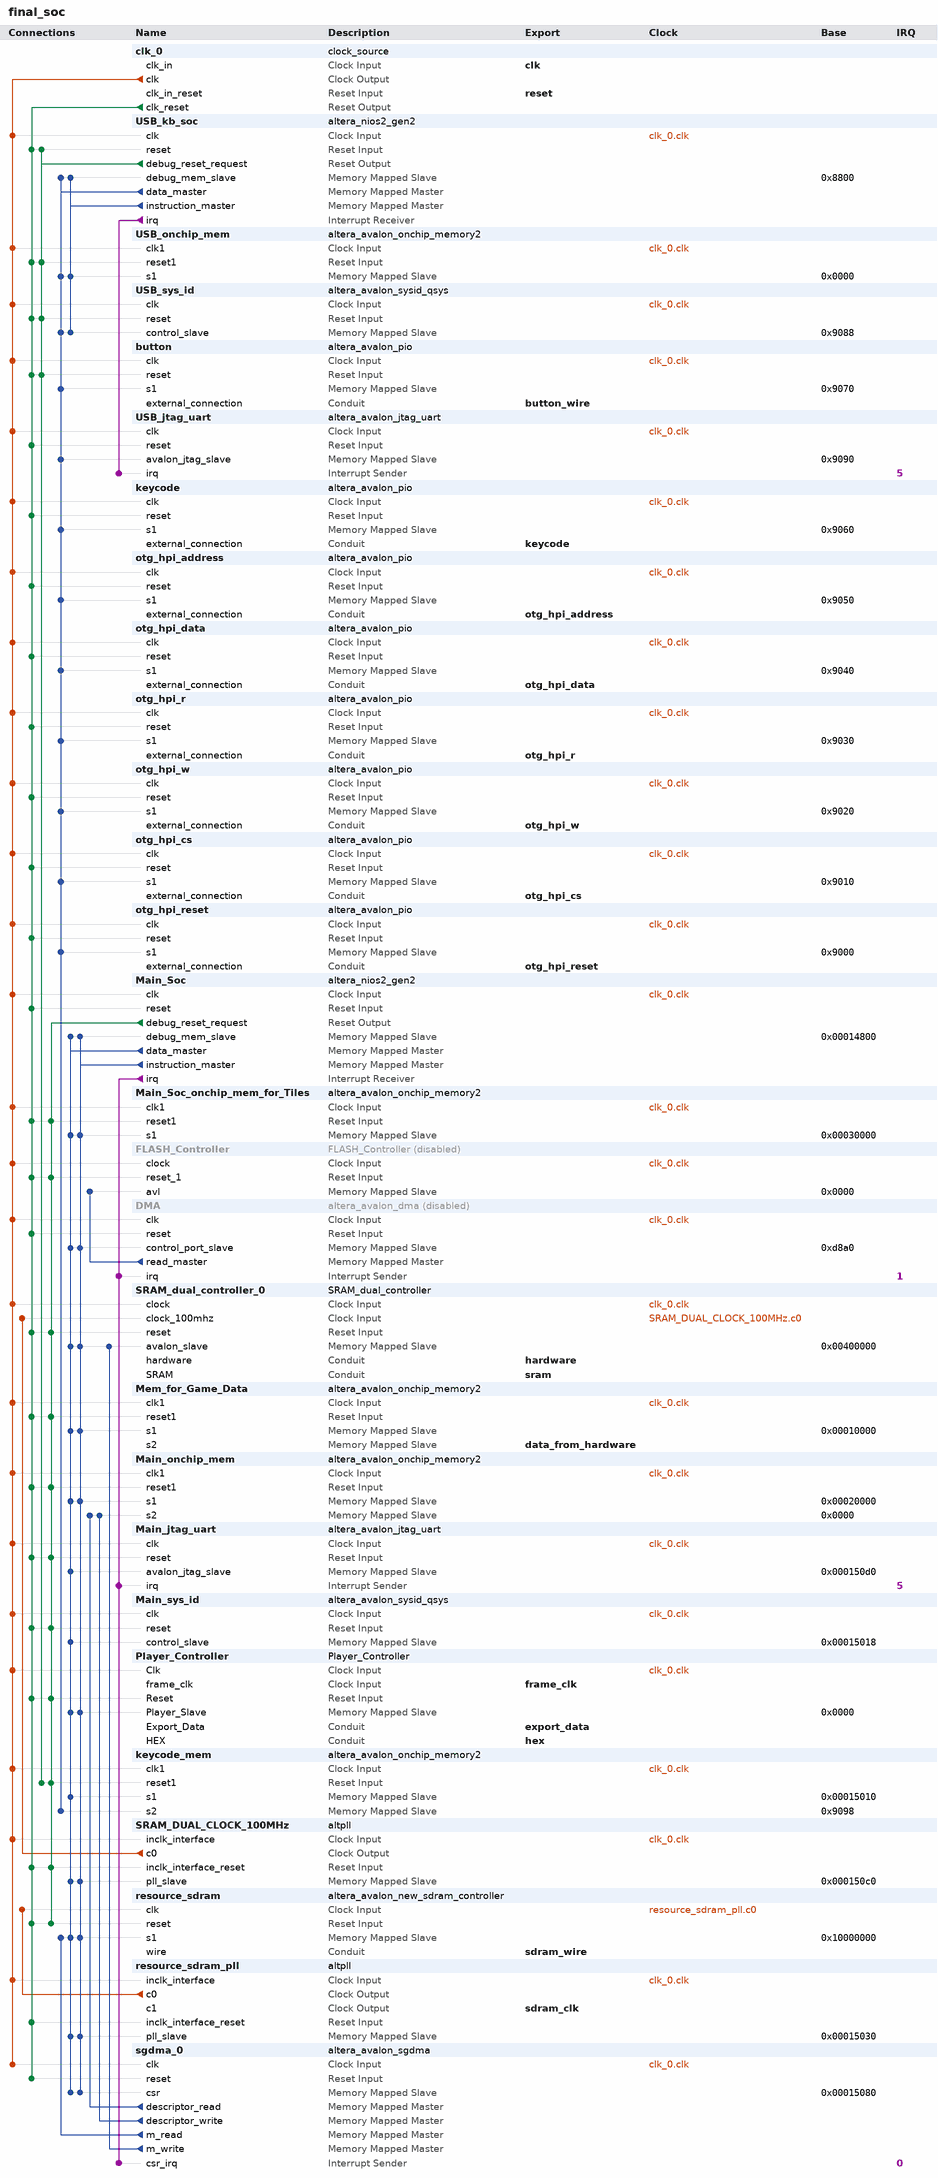
[diagram p0: system contents]
# Platform Designer (Qsys) system final_soc, Cyclone IV E EP4CE115F29C7
# Parameters at their usual value, and those the tool derives, are not listed.
package require -exact qsys 18.1
create_system final_soc
set_project_property DEVICE_FAMILY {Cyclone IV E}
set_project_property DEVICE EP4CE115F29C7

add_instance clk_0 clock_source 18.1
set_instance_parameter_value clk_0 clockFrequency 50000000

add_instance USB_kb_soc altera_nios2_gen2 18.1
set_instance_parameter_value USB_kb_soc dcache_size 2048
set_instance_parameter_value USB_kb_soc exceptionSlave USB_onchip_mem.s1
set_instance_parameter_value USB_kb_soc icache_size 4096
set_instance_parameter_value USB_kb_soc impl Tiny
set_instance_parameter_value USB_kb_soc resetSlave USB_onchip_mem.s1

add_instance USB_onchip_mem altera_avalon_onchip_memory2 18.1
set_instance_parameter_value USB_onchip_mem dataWidth 32
set_instance_parameter_value USB_onchip_mem dualPort false
set_instance_parameter_value USB_onchip_mem initMemContent true
set_instance_parameter_value USB_onchip_mem initializationFileName onchip_mem.hex
set_instance_parameter_value USB_onchip_mem memorySize 32768

add_instance USB_sys_id altera_avalon_sysid_qsys 18.1
set_instance_parameter_value USB_sys_id id 0

add_instance button altera_avalon_pio 18.1
set_instance_parameter_value button direction Input
set_instance_parameter_value button width 4

add_instance USB_jtag_uart altera_avalon_jtag_uart 18.1
set_instance_parameter_value USB_jtag_uart simInteractiveOptions NO_INTERACTIVE_WINDOWS

add_instance keycode altera_avalon_pio 18.1
set_instance_parameter_value keycode direction Output
set_instance_parameter_value keycode width 8

add_instance otg_hpi_address altera_avalon_pio 18.1
set_instance_parameter_value otg_hpi_address direction Output
set_instance_parameter_value otg_hpi_address width 2

add_instance otg_hpi_data altera_avalon_pio 18.1
set_instance_parameter_value otg_hpi_data direction InOut
set_instance_parameter_value otg_hpi_data width 16

add_instance otg_hpi_r altera_avalon_pio 18.1
set_instance_parameter_value otg_hpi_r direction Output
set_instance_parameter_value otg_hpi_r width 1

add_instance otg_hpi_w altera_avalon_pio 18.1
set_instance_parameter_value otg_hpi_w direction Output
set_instance_parameter_value otg_hpi_w width 1

add_instance otg_hpi_cs altera_avalon_pio 18.1
set_instance_parameter_value otg_hpi_cs direction Output
set_instance_parameter_value otg_hpi_cs width 1

add_instance otg_hpi_reset altera_avalon_pio 18.1
set_instance_parameter_value otg_hpi_reset direction Output
set_instance_parameter_value otg_hpi_reset width 1

add_instance Main_Soc altera_nios2_gen2 18.1
set_instance_parameter_value Main_Soc dcache_size 0
set_instance_parameter_value Main_Soc dividerType srt2
set_instance_parameter_value Main_Soc exceptionSlave Main_onchip_mem.s1
set_instance_parameter_value Main_Soc icache_size 4096
set_instance_parameter_value Main_Soc impl Tiny
set_instance_parameter_value Main_Soc resetSlave Main_onchip_mem.s1

add_instance Main_Soc_onchip_mem_for_Tiles altera_avalon_onchip_memory2 18.1
set_instance_parameter_value Main_Soc_onchip_mem_for_Tiles dataWidth 32
set_instance_parameter_value Main_Soc_onchip_mem_for_Tiles dualPort false
set_instance_parameter_value Main_Soc_onchip_mem_for_Tiles initMemContent true
set_instance_parameter_value Main_Soc_onchip_mem_for_Tiles initializationFileName onchip_mem.hex
set_instance_parameter_value Main_Soc_onchip_mem_for_Tiles memorySize 16384

add_instance FLASH_Controller FLASH_Controller 1.0
set_instance_property FLASH_Controller ENABLED false

add_instance DMA altera_avalon_dma 18.1
set_instance_property DMA ENABLED false
set_instance_parameter_value DMA allowByteTransactions true
set_instance_parameter_value DMA allowDoubleWordTransactions true
set_instance_parameter_value DMA allowHalfWordTransactions true
set_instance_parameter_value DMA allowQuadWordTransactions true
set_instance_parameter_value DMA burstEnable false
set_instance_parameter_value DMA fifoDepth 32
set_instance_parameter_value DMA maxBurstSize 128
set_instance_parameter_value DMA minimumDmaTransactionRegisterWidth 13

add_instance SRAM_dual_controller_0 SRAM_dual_controller 1.0

add_instance Mem_for_Game_Data altera_avalon_onchip_memory2 18.1
set_instance_parameter_value Mem_for_Game_Data blockType M9K
set_instance_parameter_value Mem_for_Game_Data dataWidth 32
set_instance_parameter_value Mem_for_Game_Data dualPort true
set_instance_parameter_value Mem_for_Game_Data enableDiffWidth true
set_instance_parameter_value Mem_for_Game_Data initMemContent true
set_instance_parameter_value Mem_for_Game_Data initializationFileName onchip_mem.hex
set_instance_parameter_value Mem_for_Game_Data memorySize 16384
set_instance_parameter_value Mem_for_Game_Data singleClockOperation true

add_instance Main_onchip_mem altera_avalon_onchip_memory2 18.1
set_instance_parameter_value Main_onchip_mem dataWidth 32
set_instance_parameter_value Main_onchip_mem dualPort true
set_instance_parameter_value Main_onchip_mem initMemContent true
set_instance_parameter_value Main_onchip_mem initializationFileName onchip_mem.hex
set_instance_parameter_value Main_onchip_mem memorySize 65536
set_instance_parameter_value Main_onchip_mem singleClockOperation true

add_instance Main_jtag_uart altera_avalon_jtag_uart 18.1
set_instance_parameter_value Main_jtag_uart simInteractiveOptions NO_INTERACTIVE_WINDOWS

add_instance Main_sys_id altera_avalon_sysid_qsys 18.1
set_instance_parameter_value Main_sys_id id 0

add_instance Player_Controller Player_Controller 2.3

add_instance keycode_mem altera_avalon_onchip_memory2 18.1
set_instance_parameter_value keycode_mem dataWidth 8
set_instance_parameter_value keycode_mem dualPort true
set_instance_parameter_value keycode_mem initMemContent true
set_instance_parameter_value keycode_mem initializationFileName onchip_mem.hex
set_instance_parameter_value keycode_mem memorySize 4
set_instance_parameter_value keycode_mem singleClockOperation true

add_instance SRAM_DUAL_CLOCK_100MHz altpll 18.1
set_instance_parameter_value SRAM_DUAL_CLOCK_100MHz CLK0_DIVIDE_BY 1
set_instance_parameter_value SRAM_DUAL_CLOCK_100MHz CLK0_MULTIPLY_BY 2
set_instance_parameter_value SRAM_DUAL_CLOCK_100MHz INCLK0_INPUT_FREQUENCY 20000
set_instance_parameter_value SRAM_DUAL_CLOCK_100MHz PORT_ARESET PORT_UNUSED
set_instance_parameter_value SRAM_DUAL_CLOCK_100MHz PORT_LOCKED PORT_UNUSED
set_instance_parameter_value SRAM_DUAL_CLOCK_100MHz PORT_clk1 PORT_UNUSED
set_instance_parameter_value SRAM_DUAL_CLOCK_100MHz PORT_clk2 PORT_UNUSED
set_instance_parameter_value SRAM_DUAL_CLOCK_100MHz PORT_clk3 PORT_UNUSED

add_instance resource_sdram altera_avalon_new_sdram_controller 18.1
set_instance_parameter_value resource_sdram TAC 5.5
set_instance_parameter_value resource_sdram TRCD 20.0
set_instance_parameter_value resource_sdram TRP 20.0
set_instance_parameter_value resource_sdram casLatency 3
set_instance_parameter_value resource_sdram columnWidth 10
set_instance_parameter_value resource_sdram dataWidth 32
set_instance_parameter_value resource_sdram generateSimulationModel false
set_instance_parameter_value resource_sdram model single_Micron_MT48LC4M32B2_7_chip
set_instance_parameter_value resource_sdram numberOfBanks 4
set_instance_parameter_value resource_sdram numberOfChipSelects 1
set_instance_parameter_value resource_sdram powerUpDelay 200.0
set_instance_parameter_value resource_sdram refreshPeriod 7.8125
set_instance_parameter_value resource_sdram rowWidth 13

add_instance resource_sdram_pll altpll 18.1
set_instance_parameter_value resource_sdram_pll CLK0_DIVIDE_BY 1
set_instance_parameter_value resource_sdram_pll CLK0_MULTIPLY_BY 1
set_instance_parameter_value resource_sdram_pll CLK1_DIVIDE_BY 1
set_instance_parameter_value resource_sdram_pll CLK1_DUTY_CYCLE 50
set_instance_parameter_value resource_sdram_pll CLK1_MULTIPLY_BY 1
set_instance_parameter_value resource_sdram_pll CLK1_PHASE_SHIFT -3000
set_instance_parameter_value resource_sdram_pll INCLK0_INPUT_FREQUENCY 20000
set_instance_parameter_value resource_sdram_pll PORT_ARESET PORT_UNUSED
set_instance_parameter_value resource_sdram_pll PORT_LOCKED PORT_UNUSED
set_instance_parameter_value resource_sdram_pll PORT_clk1 PORT_USED
set_instance_parameter_value resource_sdram_pll PORT_clk2 PORT_UNUSED
set_instance_parameter_value resource_sdram_pll PORT_clk3 PORT_UNUSED

add_instance sgdma_0 altera_avalon_sgdma 18.1
set_instance_parameter_value sgdma_0 enableBurstTransfers false
set_instance_parameter_value sgdma_0 enableUnalignedTransfers true
set_instance_parameter_value sgdma_0 readBlockDataWidth 32
set_instance_parameter_value sgdma_0 sinkErrorWidth 0
set_instance_parameter_value sgdma_0 sourceErrorWidth 0
set_instance_parameter_value sgdma_0 transferMode MEMORY_TO_MEMORY
set_instance_parameter_value sgdma_0 writeBurstcountWidth 4

# connections
add_connection clk_0.clk button.clk clock
add_connection clk_0.clk DMA.clk clock
add_connection clk_0.clk FLASH_Controller.clock clock
add_connection clk_0.clk keycode.clk clock
add_connection clk_0.clk keycode_mem.clk1 clock
add_connection clk_0.clk Main_jtag_uart.clk clock
add_connection clk_0.clk Main_onchip_mem.clk1 clock
add_connection clk_0.clk Main_Soc.clk clock
add_connection clk_0.clk Main_Soc_onchip_mem_for_Tiles.clk1 clock
add_connection clk_0.clk Main_sys_id.clk clock
add_connection clk_0.clk Mem_for_Game_Data.clk1 clock
add_connection clk_0.clk otg_hpi_address.clk clock
add_connection clk_0.clk otg_hpi_cs.clk clock
add_connection clk_0.clk otg_hpi_data.clk clock
add_connection clk_0.clk otg_hpi_r.clk clock
add_connection clk_0.clk otg_hpi_reset.clk clock
add_connection clk_0.clk otg_hpi_w.clk clock
add_connection clk_0.clk Player_Controller.Clk clock
add_connection clk_0.clk resource_sdram_pll.inclk_interface clock
add_connection clk_0.clk sgdma_0.clk clock
add_connection clk_0.clk SRAM_DUAL_CLOCK_100MHz.inclk_interface clock
add_connection clk_0.clk SRAM_dual_controller_0.clock clock
add_connection clk_0.clk USB_jtag_uart.clk clock
add_connection clk_0.clk USB_kb_soc.clk clock
add_connection clk_0.clk USB_onchip_mem.clk1 clock
add_connection clk_0.clk USB_sys_id.clk clock
add_connection resource_sdram_pll.c0 resource_sdram.clk clock
add_connection SRAM_DUAL_CLOCK_100MHz.c0 SRAM_dual_controller_0.clock_100mhz clock
add_connection clk_0.clk_reset button.reset reset
add_connection clk_0.clk_reset DMA.reset reset
add_connection clk_0.clk_reset FLASH_Controller.reset_1 reset
add_connection clk_0.clk_reset keycode.reset reset
add_connection clk_0.clk_reset Main_jtag_uart.reset reset
add_connection clk_0.clk_reset Main_onchip_mem.reset1 reset
add_connection clk_0.clk_reset Main_Soc.reset reset
add_connection clk_0.clk_reset Main_Soc_onchip_mem_for_Tiles.reset1 reset
add_connection clk_0.clk_reset Main_sys_id.reset reset
add_connection clk_0.clk_reset Mem_for_Game_Data.reset1 reset
add_connection clk_0.clk_reset otg_hpi_address.reset reset
add_connection clk_0.clk_reset otg_hpi_cs.reset reset
add_connection clk_0.clk_reset otg_hpi_data.reset reset
add_connection clk_0.clk_reset otg_hpi_r.reset reset
add_connection clk_0.clk_reset otg_hpi_reset.reset reset
add_connection clk_0.clk_reset otg_hpi_w.reset reset
add_connection clk_0.clk_reset Player_Controller.Reset reset
add_connection clk_0.clk_reset resource_sdram.reset reset
add_connection clk_0.clk_reset resource_sdram_pll.inclk_interface_reset reset
add_connection clk_0.clk_reset sgdma_0.reset reset
add_connection clk_0.clk_reset SRAM_DUAL_CLOCK_100MHz.inclk_interface_reset reset
add_connection clk_0.clk_reset SRAM_dual_controller_0.reset reset
add_connection clk_0.clk_reset USB_jtag_uart.reset reset
add_connection clk_0.clk_reset USB_kb_soc.reset reset
add_connection clk_0.clk_reset USB_onchip_mem.reset1 reset
add_connection clk_0.clk_reset USB_sys_id.reset reset
add_connection Main_Soc.debug_reset_request FLASH_Controller.reset_1 reset
add_connection Main_Soc.debug_reset_request keycode_mem.reset1 reset
add_connection Main_Soc.debug_reset_request Main_jtag_uart.reset reset
add_connection Main_Soc.debug_reset_request Main_onchip_mem.reset1 reset
add_connection Main_Soc.debug_reset_request Main_Soc_onchip_mem_for_Tiles.reset1 reset
add_connection Main_Soc.debug_reset_request Main_sys_id.reset reset
add_connection Main_Soc.debug_reset_request Mem_for_Game_Data.reset1 reset
add_connection Main_Soc.debug_reset_request Player_Controller.Reset reset
add_connection Main_Soc.debug_reset_request resource_sdram.reset reset
add_connection Main_Soc.debug_reset_request SRAM_DUAL_CLOCK_100MHz.inclk_interface_reset reset
add_connection Main_Soc.debug_reset_request SRAM_dual_controller_0.reset reset
add_connection USB_kb_soc.debug_reset_request button.reset reset
add_connection USB_kb_soc.debug_reset_request keycode_mem.reset1 reset
add_connection USB_kb_soc.debug_reset_request USB_kb_soc.reset reset
add_connection USB_kb_soc.debug_reset_request USB_onchip_mem.reset1 reset
add_connection USB_kb_soc.debug_reset_request USB_sys_id.reset reset
add_connection DMA.read_master FLASH_Controller.avl avalon
set_connection_parameter_value DMA.read_master/FLASH_Controller.avl baseAddress 0x0000
add_connection Main_Soc.data_master DMA.control_port_slave avalon
set_connection_parameter_value Main_Soc.data_master/DMA.control_port_slave baseAddress 0xd8a0
add_connection Main_Soc.data_master keycode_mem.s1 avalon
set_connection_parameter_value Main_Soc.data_master/keycode_mem.s1 baseAddress 0x00015010
add_connection Main_Soc.data_master Main_jtag_uart.avalon_jtag_slave avalon
set_connection_parameter_value Main_Soc.data_master/Main_jtag_uart.avalon_jtag_slave baseAddress 0x000150d0
add_connection Main_Soc.data_master Main_onchip_mem.s1 avalon
set_connection_parameter_value Main_Soc.data_master/Main_onchip_mem.s1 baseAddress 0x00020000
add_connection Main_Soc.data_master Main_Soc.debug_mem_slave avalon
set_connection_parameter_value Main_Soc.data_master/Main_Soc.debug_mem_slave baseAddress 0x00014800
add_connection Main_Soc.data_master Main_Soc_onchip_mem_for_Tiles.s1 avalon
set_connection_parameter_value Main_Soc.data_master/Main_Soc_onchip_mem_for_Tiles.s1 baseAddress 0x00030000
add_connection Main_Soc.data_master Main_sys_id.control_slave avalon
set_connection_parameter_value Main_Soc.data_master/Main_sys_id.control_slave baseAddress 0x00015018
add_connection Main_Soc.data_master Mem_for_Game_Data.s1 avalon
set_connection_parameter_value Main_Soc.data_master/Mem_for_Game_Data.s1 baseAddress 0x00010000
add_connection Main_Soc.data_master Player_Controller.Player_Slave avalon
set_connection_parameter_value Main_Soc.data_master/Player_Controller.Player_Slave baseAddress 0x0000
add_connection Main_Soc.data_master resource_sdram.s1 avalon
set_connection_parameter_value Main_Soc.data_master/resource_sdram.s1 baseAddress 0x10000000
add_connection Main_Soc.data_master resource_sdram_pll.pll_slave avalon
set_connection_parameter_value Main_Soc.data_master/resource_sdram_pll.pll_slave baseAddress 0x00015030
add_connection Main_Soc.data_master sgdma_0.csr avalon
set_connection_parameter_value Main_Soc.data_master/sgdma_0.csr baseAddress 0x00015080
add_connection Main_Soc.data_master SRAM_DUAL_CLOCK_100MHz.pll_slave avalon
set_connection_parameter_value Main_Soc.data_master/SRAM_DUAL_CLOCK_100MHz.pll_slave baseAddress 0x000150c0
add_connection Main_Soc.data_master SRAM_dual_controller_0.avalon_slave avalon
set_connection_parameter_value Main_Soc.data_master/SRAM_dual_controller_0.avalon_slave baseAddress 0x00400000
add_connection Main_Soc.instruction_master DMA.control_port_slave avalon
set_connection_parameter_value Main_Soc.instruction_master/DMA.control_port_slave baseAddress 0xd8a0
add_connection Main_Soc.instruction_master Main_onchip_mem.s1 avalon
set_connection_parameter_value Main_Soc.instruction_master/Main_onchip_mem.s1 baseAddress 0x00020000
add_connection Main_Soc.instruction_master Main_Soc.debug_mem_slave avalon
set_connection_parameter_value Main_Soc.instruction_master/Main_Soc.debug_mem_slave baseAddress 0x00014800
add_connection Main_Soc.instruction_master Main_Soc_onchip_mem_for_Tiles.s1 avalon
set_connection_parameter_value Main_Soc.instruction_master/Main_Soc_onchip_mem_for_Tiles.s1 baseAddress 0x00030000
add_connection Main_Soc.instruction_master Mem_for_Game_Data.s1 avalon
set_connection_parameter_value Main_Soc.instruction_master/Mem_for_Game_Data.s1 baseAddress 0x00010000
add_connection Main_Soc.instruction_master Player_Controller.Player_Slave avalon
set_connection_parameter_value Main_Soc.instruction_master/Player_Controller.Player_Slave baseAddress 0x0000
add_connection Main_Soc.instruction_master resource_sdram.s1 avalon
set_connection_parameter_value Main_Soc.instruction_master/resource_sdram.s1 baseAddress 0x10000000
add_connection Main_Soc.instruction_master resource_sdram_pll.pll_slave avalon
set_connection_parameter_value Main_Soc.instruction_master/resource_sdram_pll.pll_slave baseAddress 0x00015030
add_connection Main_Soc.instruction_master sgdma_0.csr avalon
set_connection_parameter_value Main_Soc.instruction_master/sgdma_0.csr baseAddress 0x00015080
add_connection Main_Soc.instruction_master SRAM_DUAL_CLOCK_100MHz.pll_slave avalon
set_connection_parameter_value Main_Soc.instruction_master/SRAM_DUAL_CLOCK_100MHz.pll_slave baseAddress 0x000150c0
add_connection Main_Soc.instruction_master SRAM_dual_controller_0.avalon_slave avalon
set_connection_parameter_value Main_Soc.instruction_master/SRAM_dual_controller_0.avalon_slave baseAddress 0x00400000
add_connection sgdma_0.descriptor_read Main_onchip_mem.s2 avalon
set_connection_parameter_value sgdma_0.descriptor_read/Main_onchip_mem.s2 baseAddress 0x0000
add_connection sgdma_0.descriptor_write Main_onchip_mem.s2 avalon
set_connection_parameter_value sgdma_0.descriptor_write/Main_onchip_mem.s2 baseAddress 0x0000
add_connection sgdma_0.m_read resource_sdram.s1 avalon
set_connection_parameter_value sgdma_0.m_read/resource_sdram.s1 baseAddress 0x10000000
add_connection sgdma_0.m_write SRAM_dual_controller_0.avalon_slave avalon
set_connection_parameter_value sgdma_0.m_write/SRAM_dual_controller_0.avalon_slave baseAddress 0x00400000
add_connection USB_kb_soc.data_master button.s1 avalon
set_connection_parameter_value USB_kb_soc.data_master/button.s1 baseAddress 0x9070
add_connection USB_kb_soc.data_master keycode.s1 avalon
set_connection_parameter_value USB_kb_soc.data_master/keycode.s1 baseAddress 0x9060
add_connection USB_kb_soc.data_master keycode_mem.s2 avalon
set_connection_parameter_value USB_kb_soc.data_master/keycode_mem.s2 baseAddress 0x9098
add_connection USB_kb_soc.data_master otg_hpi_address.s1 avalon
set_connection_parameter_value USB_kb_soc.data_master/otg_hpi_address.s1 baseAddress 0x9050
add_connection USB_kb_soc.data_master otg_hpi_cs.s1 avalon
set_connection_parameter_value USB_kb_soc.data_master/otg_hpi_cs.s1 baseAddress 0x9010
add_connection USB_kb_soc.data_master otg_hpi_data.s1 avalon
set_connection_parameter_value USB_kb_soc.data_master/otg_hpi_data.s1 baseAddress 0x9040
add_connection USB_kb_soc.data_master otg_hpi_r.s1 avalon
set_connection_parameter_value USB_kb_soc.data_master/otg_hpi_r.s1 baseAddress 0x9030
add_connection USB_kb_soc.data_master otg_hpi_reset.s1 avalon
set_connection_parameter_value USB_kb_soc.data_master/otg_hpi_reset.s1 baseAddress 0x9000
add_connection USB_kb_soc.data_master otg_hpi_w.s1 avalon
set_connection_parameter_value USB_kb_soc.data_master/otg_hpi_w.s1 baseAddress 0x9020
add_connection USB_kb_soc.data_master USB_jtag_uart.avalon_jtag_slave avalon
set_connection_parameter_value USB_kb_soc.data_master/USB_jtag_uart.avalon_jtag_slave baseAddress 0x9090
add_connection USB_kb_soc.data_master USB_kb_soc.debug_mem_slave avalon
set_connection_parameter_value USB_kb_soc.data_master/USB_kb_soc.debug_mem_slave baseAddress 0x8800
add_connection USB_kb_soc.data_master USB_onchip_mem.s1 avalon
set_connection_parameter_value USB_kb_soc.data_master/USB_onchip_mem.s1 baseAddress 0x0000
add_connection USB_kb_soc.data_master USB_sys_id.control_slave avalon
set_connection_parameter_value USB_kb_soc.data_master/USB_sys_id.control_slave baseAddress 0x9088
add_connection USB_kb_soc.instruction_master USB_kb_soc.debug_mem_slave avalon
set_connection_parameter_value USB_kb_soc.instruction_master/USB_kb_soc.debug_mem_slave baseAddress 0x8800
add_connection USB_kb_soc.instruction_master USB_onchip_mem.s1 avalon
set_connection_parameter_value USB_kb_soc.instruction_master/USB_onchip_mem.s1 baseAddress 0x0000
add_connection USB_kb_soc.instruction_master USB_sys_id.control_slave avalon
set_connection_parameter_value USB_kb_soc.instruction_master/USB_sys_id.control_slave baseAddress 0x9088
add_connection Main_Soc.irq DMA.irq interrupt
set_connection_parameter_value Main_Soc.irq/DMA.irq irqNumber 1
add_connection Main_Soc.irq Main_jtag_uart.irq interrupt
set_connection_parameter_value Main_Soc.irq/Main_jtag_uart.irq irqNumber 5
add_connection Main_Soc.irq sgdma_0.csr_irq interrupt
set_connection_parameter_value Main_Soc.irq/sgdma_0.csr_irq irqNumber 0
add_connection USB_kb_soc.irq USB_jtag_uart.irq interrupt
set_connection_parameter_value USB_kb_soc.irq/USB_jtag_uart.irq irqNumber 5

# exported interfaces
add_interface button_wire conduit end
set_interface_property button_wire EXPORT_OF button.external_connection
add_interface clk clock sink
set_interface_property clk EXPORT_OF clk_0.clk_in
add_interface data_from_hardware avalon slave
set_interface_property data_from_hardware EXPORT_OF Mem_for_Game_Data.s2
add_interface export_data conduit end
set_interface_property export_data EXPORT_OF Player_Controller.Export_Data
add_interface frame_clk clock sink
set_interface_property frame_clk EXPORT_OF Player_Controller.frame_clk
add_interface hardware conduit end
set_interface_property hardware EXPORT_OF SRAM_dual_controller_0.hardware
add_interface hex conduit end
set_interface_property hex EXPORT_OF Player_Controller.HEX
add_interface keycode conduit end
set_interface_property keycode EXPORT_OF keycode.external_connection
add_interface otg_hpi_address conduit end
set_interface_property otg_hpi_address EXPORT_OF otg_hpi_address.external_connection
add_interface otg_hpi_cs conduit end
set_interface_property otg_hpi_cs EXPORT_OF otg_hpi_cs.external_connection
add_interface otg_hpi_data conduit end
set_interface_property otg_hpi_data EXPORT_OF otg_hpi_data.external_connection
add_interface otg_hpi_r conduit end
set_interface_property otg_hpi_r EXPORT_OF otg_hpi_r.external_connection
add_interface otg_hpi_reset conduit end
set_interface_property otg_hpi_reset EXPORT_OF otg_hpi_reset.external_connection
add_interface otg_hpi_w conduit end
set_interface_property otg_hpi_w EXPORT_OF otg_hpi_w.external_connection
add_interface reset reset sink
set_interface_property reset EXPORT_OF clk_0.clk_in_reset
add_interface sdram_clk clock source
set_interface_property sdram_clk EXPORT_OF resource_sdram_pll.c1
add_interface sdram_wire conduit end
set_interface_property sdram_wire EXPORT_OF resource_sdram.wire
add_interface sram conduit end
set_interface_property sram EXPORT_OF SRAM_dual_controller_0.SRAM

set_interconnect_requirement {$system} qsys_mm.clockCrossingAdapter HANDSHAKE
set_interconnect_requirement {$system} qsys_mm.enableEccProtection FALSE
set_interconnect_requirement {$system} qsys_mm.insertDefaultSlave FALSE
set_interconnect_requirement {$system} qsys_mm.maxAdditionalLatency 1

save_system final_soc.qsys
